# EAGLE schematic ShematicPCB (EAGLE 9.0.0)
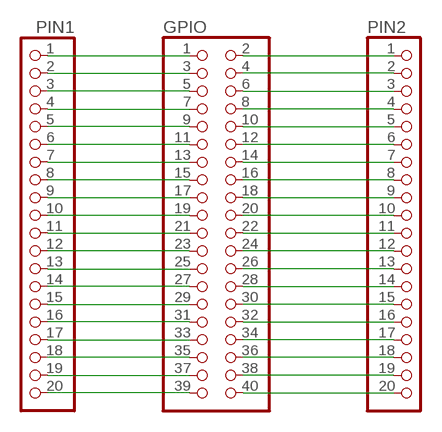
[diagram p0: schematic, sheet 1]

## Parts
GPIO  PINHD-2X20  [2X20]
PIN1  PINHD-1X20  [1X20]
PIN2  PINHD-1X20  [1X20]

## Nets
GND: GPIO.21 PIN1.11
N$1: GPIO.1 PIN1.1
N$2: GPIO.9 PIN1.5
N$3: GPIO.3 PIN1.2
N$4: GPIO.5 PIN1.3
N$5: GPIO.7 PIN1.4
N$6: GPIO.11 PIN1.6
N$7: GPIO.13 PIN1.7
N$8: GPIO.15 PIN1.8
N$9: GPIO.17 PIN1.9
N$10: GPIO.19 PIN1.10
N$11: GPIO.2 PIN2.1
N$13: GPIO.25 PIN1.13
N$14: GPIO.27 PIN1.14
N$15: GPIO.29 PIN1.15
N$16: GPIO.31 PIN1.16
N$17: GPIO.33 PIN1.17
N$18: GPIO.35 PIN1.18
N$19: GPIO.37 PIN1.19
N$20: GPIO.39 PIN1.20
N$21: GPIO.40 PIN2.20
N$22: GPIO.38 PIN2.19
N$23: GPIO.36 PIN2.18
N$24: GPIO.34 PIN2.17
N$25: GPIO.32 PIN2.16
N$26: GPIO.30 PIN2.15
N$27: GPIO.28 PIN2.14
N$28: GPIO.26 PIN2.13
N$29: GPIO.24 PIN2.12
N$30: GPIO.22 PIN2.11
N$31: GPIO.20 PIN2.10
N$32: GPIO.18 PIN2.9
N$33: GPIO.16 PIN2.8
N$34: GPIO.14 PIN2.7
N$35: GPIO.12 PIN2.6
N$36: GPIO.10 PIN2.5
N$37: GPIO.8 PIN2.4
N$38: GPIO.6 PIN2.3
N$39: GPIO.4 PIN2.2
VCC: GPIO.23 PIN1.12

## Library data of the parts
GPIO = pinhead:PINHD-2X20: PIN HEADER
PIN1 PIN2 = pinhead:PINHD-1X20: PIN HEADER